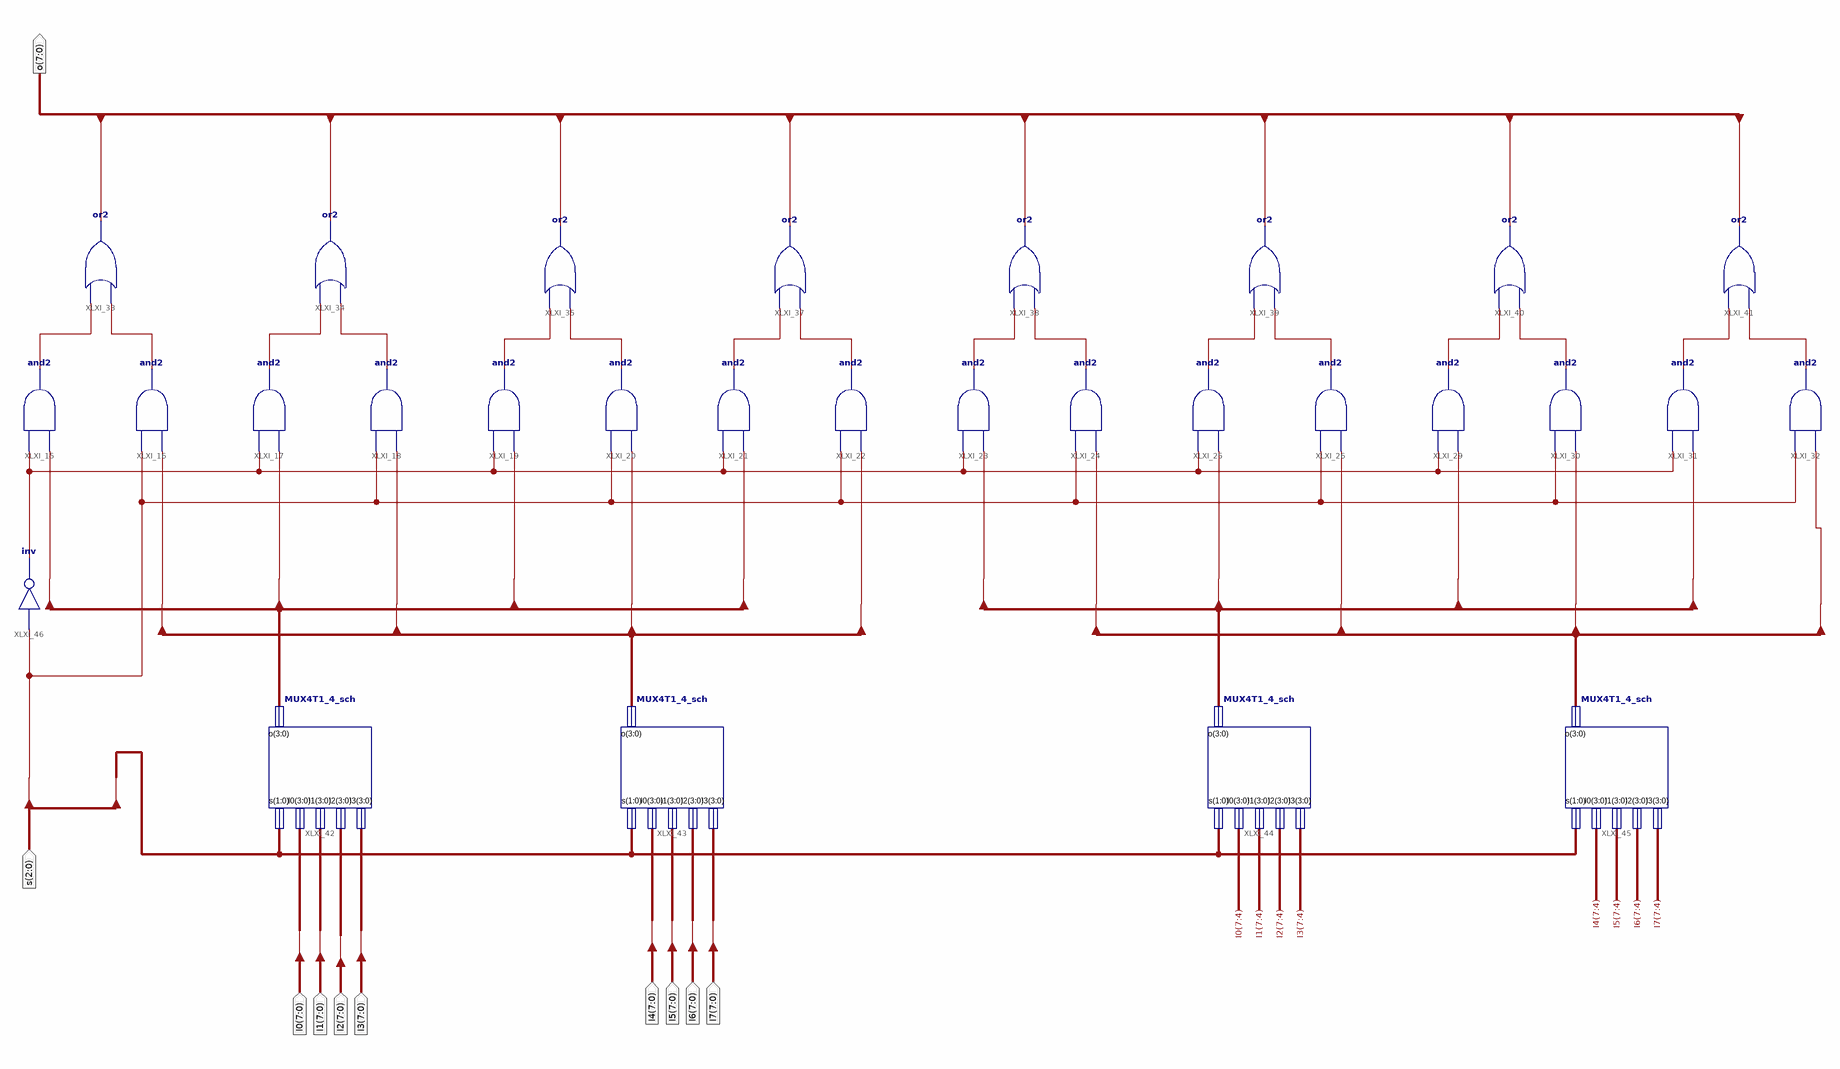
[diagram p0: schematic sheet 1]
// Xilinx ISE schematic MUX8T1_8_sch.sch (kintex7) as structural Verilog: 29 symbols, 10 ports
module MUX8T1_8_sch (
  input  [2:0] s,
  input  [7:0] I0,
  input  [7:0] I2,
  input  [7:0] I3,
  input  [7:0] I4,
  input  [7:0] I5,
  input  [7:0] I6,
  input  [7:0] I7,
  input  [7:0] I1,
  output [7:0] o
);

  wire XLXN_1, XLXN_2, XLXN_3, XLXN_4, XLXN_6, XLXN_7, XLXN_8, XLXN_9, XLXN_10, XLXN_11, XLXN_12, XLXN_13,
       XLXN_14, XLXN_15, XLXN_16, XLXN_17, XLXN_29;
  wire [3:0] o0, o1, o2, o3;

  and XLXI_15 (XLXN_1, o0[0], XLXN_29);
  and XLXI_16 (XLXN_2, o1[0], s[2]);
  and XLXI_17 (XLXN_3, o0[1], XLXN_29);
  and XLXI_18 (XLXN_4, o1[1], s[2]);
  and XLXI_19 (XLXN_7, o0[2], XLXN_29);
  and XLXI_20 (XLXN_6, o1[2], s[2]);
  and XLXI_21 (XLXN_8, o0[3], XLXN_29);
  and XLXI_22 (XLXN_9, o1[3], s[2]);
  and XLXI_23 (XLXN_10, o2[0], XLXN_29);
  and XLXI_24 (XLXN_11, o3[0], s[2]);
  and XLXI_25 (XLXN_12, o2[1], XLXN_29);
  and XLXI_26 (XLXN_13, o3[1], s[2]);
  and XLXI_29 (XLXN_14, o2[2], XLXN_29);
  and XLXI_30 (XLXN_15, o3[2], s[2]);
  and XLXI_31 (XLXN_16, o2[3], XLXN_29);
  and XLXI_32 (XLXN_17, o3[3], s[2]);
  or XLXI_33 (o[0], XLXN_2, XLXN_1);
  or XLXI_34 (o[1], XLXN_4, XLXN_3);
  or XLXI_35 (o[2], XLXN_6, XLXN_7);
  or XLXI_37 (o[3], XLXN_9, XLXN_8);
  or XLXI_38 (o[4], XLXN_11, XLXN_10);
  or XLXI_39 (o[5], XLXN_13, XLXN_12);
  or XLXI_40 (o[6], XLXN_15, XLXN_14);
  or XLXI_41 (o[7], XLXN_17, XLXN_16);
  MUX4T1_4_sch XLXI_42 (.s(s[1:0]), .I0(I0[3:0]), .I1(I1[3:0]), .I2(I2[3:0]), .I3(I3[3:0]), .o(o0));
  MUX4T1_4_sch XLXI_43 (.s(s[1:0]), .I0(I4[3:0]), .I1(I5[3:0]), .I2(I6[3:0]), .I3(I7[3:0]), .o(o1));
  MUX4T1_4_sch XLXI_44 (.s(s[1:0]), .I0(I0[7:4]), .I1(I1[7:4]), .I2(I2[7:4]), .I3(I3[7:4]), .o(o2));
  MUX4T1_4_sch XLXI_45 (.s(s[1:0]), .I0(I4[7:4]), .I1(I5[7:4]), .I2(I6[7:4]), .I3(I7[7:4]), .o(o3));
  not XLXI_46 (XLXN_29, s[2]);
endmodule
